# Altium schematic sheet tx.SchDoc
size Legal; CompanyName: Signal Laboratories, Inc.; Address1: 3479 Edison Way; Address2: Menlo Park CA 94025; Address3: +1 (877) 778-8435; Address4: siglabs.com; Revision: 1; SheetNumber: 1; SheetTotal: 1
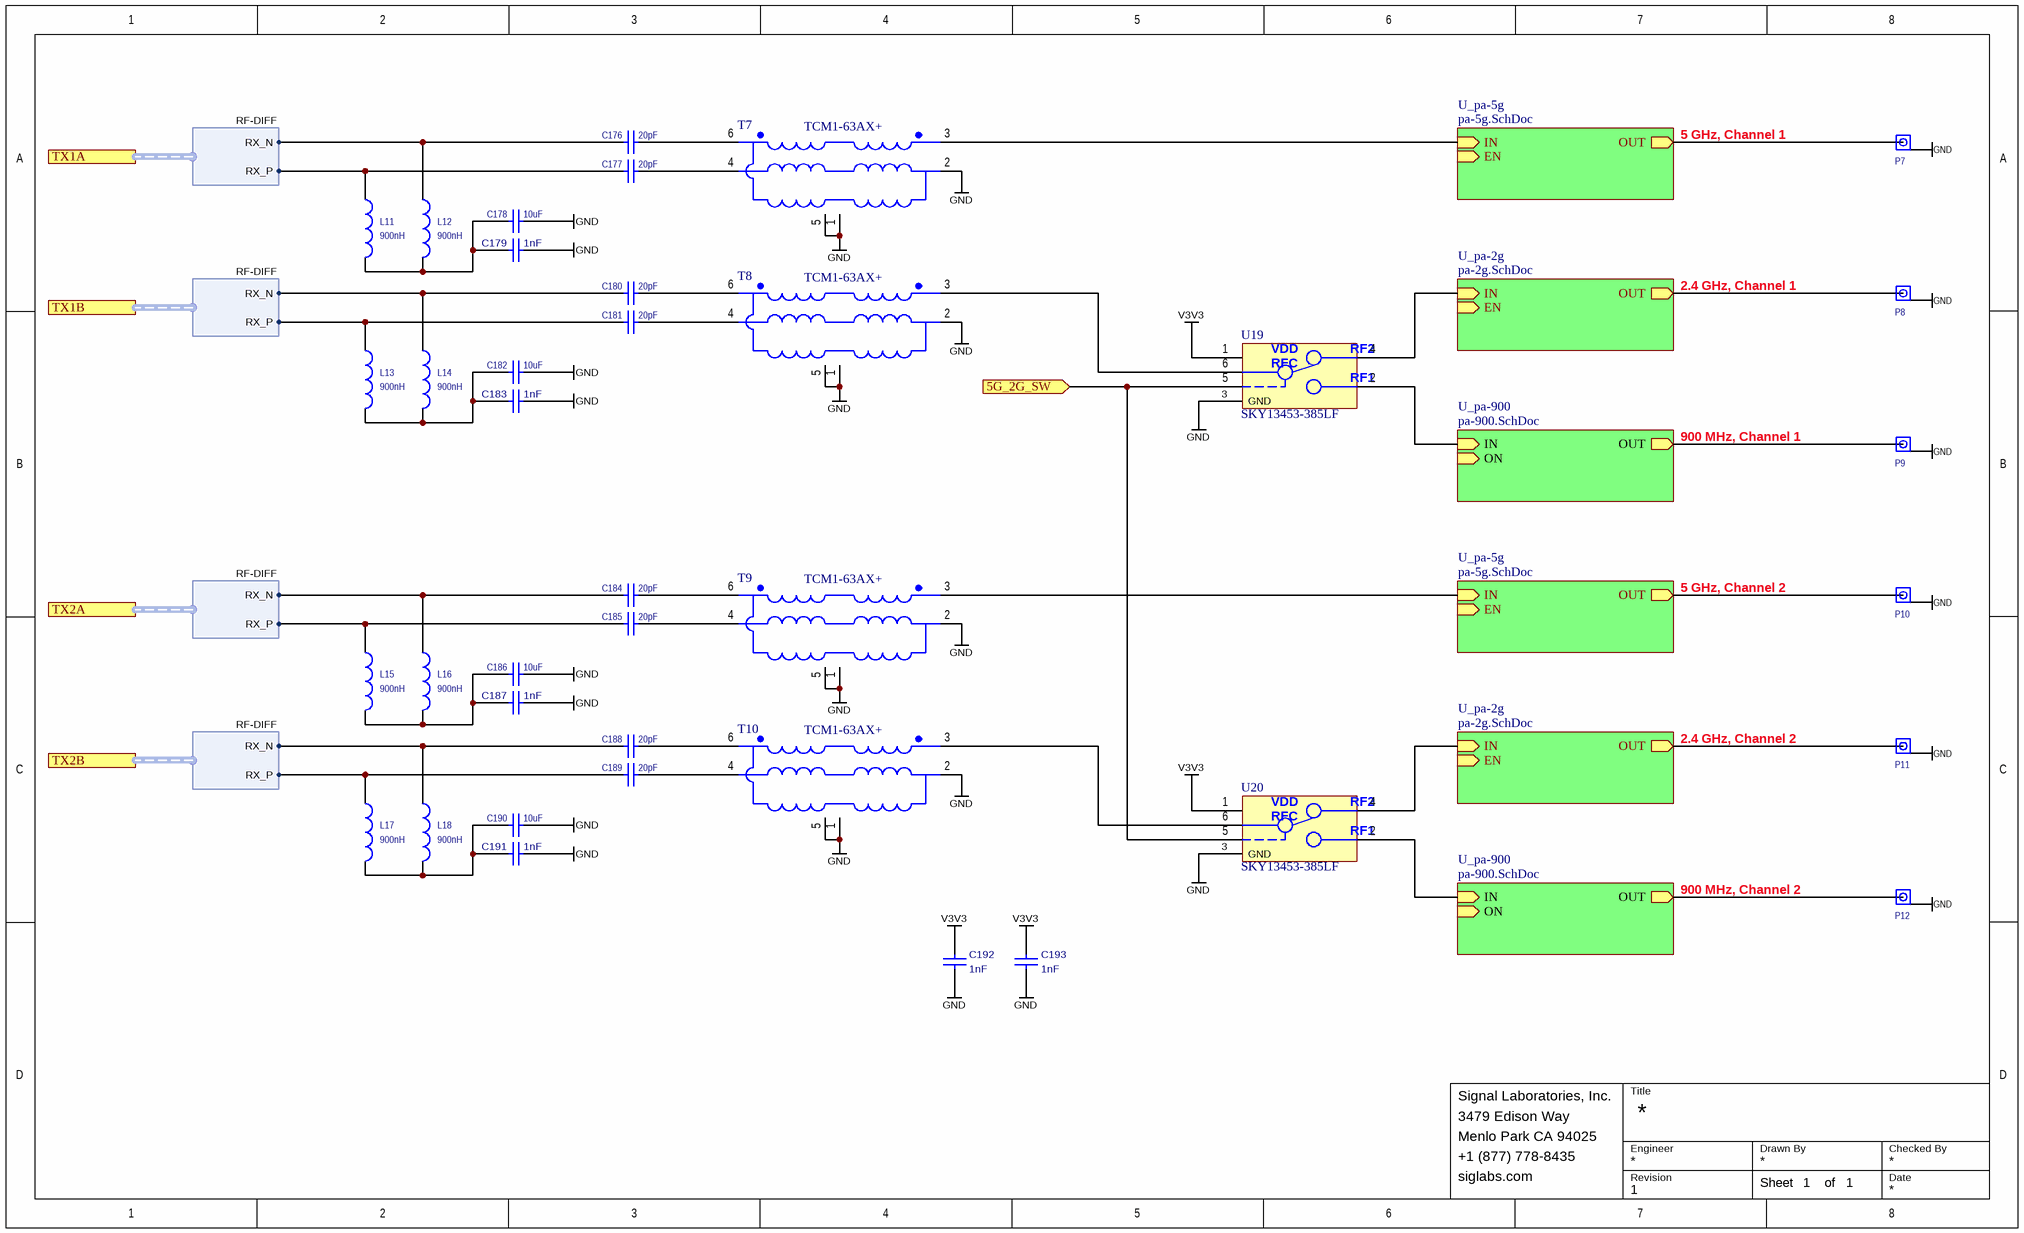
[diagram p0: tx.SchDoc]

## Parts
C176  value 20pF  [0402]  (hidden comment: CBR04C200F5GAC)
C177  value 20pF  [0402]  (hidden comment: CBR04C200F5GAC)
C178  value 10uF  [0603]  (hidden comment: CL10A106MA8NRNC)
C179  value 1nF  [CAPC160X80X90L20N]  (hidden comment: VJ0402Y102KXA)
C180  value 20pF  [0402]  (hidden comment: CBR04C200F5GAC)
C181  value 20pF  [0402]  (hidden comment: CBR04C200F5GAC)
C182  value 10uF  [0603]  (hidden comment: CL10A106MA8NRNC)
C183  value 1nF  [CAPC160X80X90L20N]  (hidden comment: VJ0402Y102KXA)
C184  value 20pF  [0402]  (hidden comment: CBR04C200F5GAC)
C185  value 20pF  [0402]  (hidden comment: CBR04C200F5GAC)
C186  value 10uF  [0603]  (hidden comment: CL10A106MA8NRNC)
C187  value 1nF  [CAPC160X80X90L20N]  (hidden comment: VJ0402Y102KXA)
C188  value 20pF  [0402]  (hidden comment: CBR04C200F5GAC)
C189  value 20pF  [0402]  (hidden comment: CBR04C200F5GAC)
C190  value 10uF  [0603]  (hidden comment: CL10A106MA8NRNC)
C191  value 1nF  [CAPC160X80X90L20N]  (hidden comment: VJ0402Y102KXA)
C192  value 1nF  [CAPC160X80X90L20N]  (hidden comment: VJ0402Y102KXA)
C193  value 1nF  [CAPC160X80X90L20N]  (hidden comment: VJ0402Y102KXA)
L11  value 900nH  [COILCRAFT_1008AF]  (hidden comment: 1008AF-901XJLC)
L12  value 900nH  [COILCRAFT_1008AF]  (hidden comment: 1008AF-901XJLC)
L13  value 900nH  [COILCRAFT_1008AF]  (hidden comment: 1008AF-901XJLC)
L14  value 900nH  [COILCRAFT_1008AF]  (hidden comment: 1008AF-901XJLC)
L15  value 900nH  [COILCRAFT_1008AF]  (hidden comment: 1008AF-901XJLC)
L16  value 900nH  [COILCRAFT_1008AF]  (hidden comment: 1008AF-901XJLC)
L17  value 900nH  [COILCRAFT_1008AF]  (hidden comment: 1008AF-901XJLC)
L18  value 900nH  [COILCRAFT_1008AF]  (hidden comment: 1008AF-901XJLC)
P7  U.FL-R-SMT(10)  [U.FL-R-SMT(10)]  (value not drawn)
P8  U.FL-R-SMT(10)  [U.FL-R-SMT(10)]  (value not drawn)
P9  U.FL-R-SMT(10)  [U.FL-R-SMT(10)]  (value not drawn)
P10  U.FL-R-SMT(10)  [U.FL-R-SMT(10)]  (value not drawn)
P11  U.FL-R-SMT(10)  [U.FL-R-SMT(10)]  (value not drawn)
P12  U.FL-R-SMT(10)  [U.FL-R-SMT(10)]  (value not drawn)
T7  TCM1-63AX+  [TCM1-63AX+]
T8  TCM1-63AX+  [TCM1-63AX+]
T9  TCM1-63AX+  [TCM1-63AX+]
T10  TCM1-63AX+  [TCM1-63AX+]
U19  SKY13453-385LF  [SKY13453-385LF]
U20  SKY13453-385LF  [SKY13453-385LF]

## Sub-sheets
U_pa-2g = pa-2g.SchDoc: OUT (out), IN (in), EN (in)
U_pa-2g = pa-2g.SchDoc: OUT (out), IN (in), EN (in)
U_pa-5g = pa-5g.SchDoc: OUT (out), IN (in), EN (in)
U_pa-5g = pa-5g.SchDoc: OUT (out), IN (in), EN (in)
U_pa-900 = pa-900.SchDoc: IN (in), OUT (out), ON (in)
U_pa-900 = pa-900.SchDoc: IN (in), OUT (out), ON (in)

## Ports
5G_2G_SW (in), TX1A (harness RF-DIFF), TX1B (harness RF-DIFF), TX2A (harness RF-DIFF), TX2B (harness RF-DIFF)

## Harnesses
RF-DIFF: RX_N, RX_P

## Nets
GND: C178.1 C179.2 C182.1 C183.2 C186.1 C187.2 C190.1 C191.2 C192.1 C193.1 P7.2(GND) P8.2(GND) P9.2(GND) P10.2(GND) P11.2(GND) P12.2(GND) T7.1 T7.2 T7.5 T8.1 T8.2 T8.5 T9.1 T9.2 T9.5 T10.1 T10.2 T10.5 U19.3(GND) U20.3(GND)
V3V3: C192.2 C193.2 U19.1(VDD) U20.1(VDD)
5G_2G_SW: U19.5(CTL) U20.5(CTL) ; port 5G_2G_SW
NetC176_1: C176.1 L12.1 ; port TX1A.RX_N
NetC176_2: C176.2 T7.6
NetC177_1: C177.1 L11.1 ; port TX1A.RX_P
NetC177_2: C177.2 T7.4
NetC178_2: C178.2 C179.1 L11.2 L12.2
NetC180_1: C180.1 L14.1 ; port TX1B.RX_N
NetC180_2: C180.2 T8.6
NetC181_1: C181.1 L13.1 ; port TX1B.RX_P
NetC181_2: C181.2 T8.4
NetC182_2: C182.2 C183.1 L13.2 L14.2
NetC184_1: C184.1 L16.1 ; port TX2A.RX_N
NetC184_2: C184.2 T9.6
NetC185_1: C185.1 L15.1 ; port TX2A.RX_P
NetC185_2: C185.2 T9.4
NetC186_2: C186.2 C187.1 L15.2 L16.2
NetC188_1: C188.1 L18.1 ; port TX2B.RX_N
NetC188_2: C188.2 T10.6
NetC189_1: C189.1 L17.1 ; port TX2B.RX_P
NetC189_2: C189.2 T10.4
NetC190_2: C190.2 C191.1 L17.2 L18.2
NetP7_1: P7.1(RF) ; sheet U_pa-5g/OUT
NetP8_1: P8.1(RF) ; sheet U_pa-2g/OUT
NetP9_1: P9.1(RF) ; sheet U_pa-900/OUT
NetP10_1: P10.1(RF) ; sheet U_pa-5g/OUT
NetP11_1: P11.1(RF) ; sheet U_pa-2g/OUT
NetP12_1: P12.1(RF) ; sheet U_pa-900/OUT
NetT7_3: T7.3 ; sheet U_pa-5g/IN
NetT8_3: T8.3 U19.6(J1)
NetT9_3: T9.3 ; sheet U_pa-5g/IN
NetT10_3: T10.3 U20.6(J1)
NetU19_2: U19.2(RF1) ; sheet U_pa-900/IN
NetU19_4: U19.4(RF2) ; sheet U_pa-2g/IN
NetU20_2: U20.2(RF1) ; sheet U_pa-900/IN
NetU20_4: U20.4(RF2) ; sheet U_pa-2g/IN

## Notes on the sheet
- 5 GHz, Channel 1
- 2.4 GHz, Channel 1
- 900 MHz, Channel 1
- 5 GHz, Channel 2
- 2.4 GHz, Channel 2
- 900 MHz, Channel 2
- Title
- Engineer
- Revision
- Drawn By
- Checked By
- Date
- Sheet
- of
- (in symbol SKY13453-385LF) RFC

## Library data of the parts
C176 C177 C180 C181 C184 C185 C188 C189 = CAP 0402: Ceramic Capacitor 20pF ±1% 50V NP0 0402; Manufacturer: Kemet; Tr: -55:125; Voltage: 50V; Manufacturer P/N: CBR04C200F5GAC; Package: 0402; Tolerance: ±1%
C178 C182 C186 C190 = CAP 0603: Ceramic Capacitor 10uF ±20% 25V X5R 0603; Manufacturer: Samsung; Tr: -55:85; Manufacturer P/N: CL10A106MA8NRNC; Voltage: 25V; Package: 0603; Tolerance: ±20%
C179 C183 C187 C191-C193 = VJ0402Y102KXA: Ceramic Capacitor 1nF ±10% 50V X7R 0402; Manufacturer: Vishay; Tr: -55:150; pF: 1000; Manufacturer P/N: VJ0402Y102KXA; Tolerance: ±10%; Package: 0402; Voltage: 50V
L11-L18 = INDUCTOR: Chip Inductor 900nH ±5% 1008; Manufacturer: Coilcraft; Tr: -40:125; Manufacturer P/N: 1008AF-901XJLC; Package: 1008; Tolerance: ±5%
P7-P12 = U.FL-R-SMT(10): Ultra Miniature Coaxial Jack, 50 Ohms; Manufacturer: Hirose; Manufacturer P/N: U.FL-R-SMT(10)
T7-T10 = TCM1-63AX+: RF Transformer 10-6000KHz; Manufacturer: Mini-Circuits; Manufacturer P/N: TC1-1-13M
U19 U20 = SKY13453-385LF: 0.01 MHz-6.0 GHz RF SPDT Switch; Manufacturer: Skyworks; Manufacturer P/N: SKY13453-385LF